# Altium schematic sheet Radio.SchDoc
size B; SheetNumber: 1; SheetTotal: 1
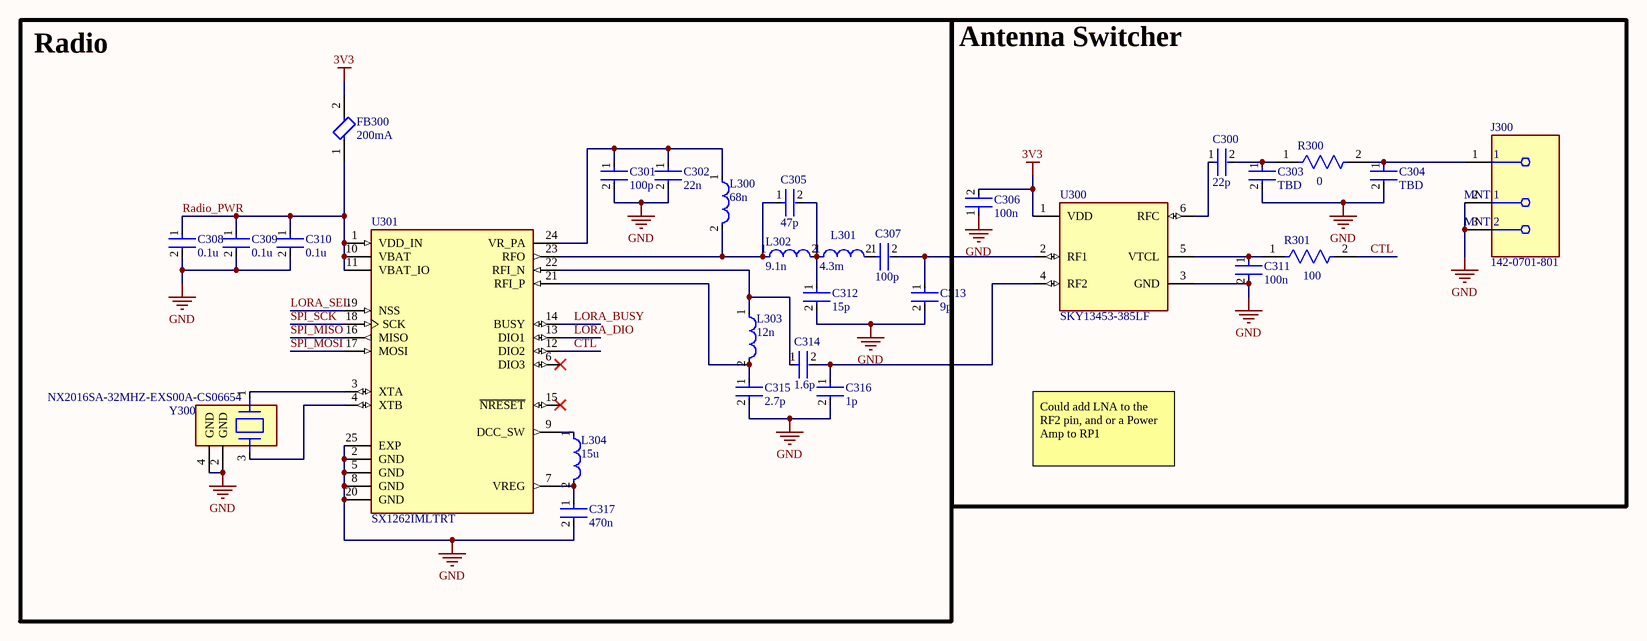
[diagram p0: Radio.SchDoc]

## Parts
C300  Capacitance: 22p  [FP-CL10-IPC_A]  (hidden comment: CL10C681JB8NFNC)
C301  Capacitance: 100p  [FP-CL10-IPC_A]  (hidden comment: CL10C681JB8NFNC)
C302  Capacitance: 22n  [FP-CL10-IPC_A]  (hidden comment: CL10C681JB8NFNC)
C303  Capacitance: TBD  [FP-CL10-IPC_A]  (hidden comment: CL10C681JB8NFNC)
C304  Capacitance: TBD  [FP-CL10-IPC_A]  (hidden comment: CL10C681JB8NFNC)
C305  Capacitance: 47p  [FP-CL10-IPC_A]  (hidden comment: CL10C681JB8NFNC)
C306  Capacitance: 100n  [FP-CL10-IPC_A]  (hidden comment: CL10C681JB8NFNC)
C307  Capacitance: 100p  [FP-CL10-IPC_A]  (hidden comment: CL10C681JB8NFNC)
C308  Capacitance: 0.1u  [FP-CL10-IPC_A]  (hidden comment: CL10C681JB8NFNC)
C309  Capacitance: 0.1u  [FP-CL10-IPC_A]  (hidden comment: CL10C681JB8NFNC)
C310  Capacitance: 0.1u  [FP-CL10-IPC_A]  (hidden comment: CL10C681JB8NFNC)
C311  Capacitance: 100n  [FP-CL10-IPC_A]  (hidden comment: CL10C681JB8NFNC)
C312  Capacitance: 15p  [FP-CL10-IPC_A]  (hidden comment: CL10C681JB8NFNC)
C313  Capacitance: 9p  [FP-CL10-IPC_A]  (hidden comment: CL10C681JB8NFNC)
C314  Capacitance: 1.6p  [FP-CL10-IPC_A]  (hidden comment: CL10C681JB8NFNC)
C315  Capacitance: 2.7p  [FP-CL10-IPC_A]  (hidden comment: CL10C681JB8NFNC)
C316  Capacitance: 1p  [FP-CL10-IPC_A]  (hidden comment: CL10C681JB8NFNC)
C317  Capacitance: 470n  [FP-CL10-IPC_A]  (hidden comment: CL10C681JB8NFNC)
FB300  200mA  [FP-BLM18-0_15-t0_8-IPC_B]
J300  142-0701-801  [FP-142-0701-801-MFG]
L300  68n  [FP-LQM18NN_00-IPC_B]
L301  4.3m  [FP-LQM18NN_00-IPC_B]
L302  9.1n  [FP-LQM18NN_00-IPC_B]
L303  12n  [FP-LQM18NN_00-IPC_B]
L304  15u  [FP-LQM18NN_00-IPC_B]
R300  value 0  [FP-CPF0603-MFG]  (hidden comment: CPF0603B2K15E1)
R301  value 100  [FP-CPF0603-MFG]  (hidden comment: CPF0603B2K15E1)
U300  SKY13453-385LF  [IC_SKY13453-385LF]
U301  SX1262IMLTRT  [QFN50P400X400X100-25N]
Y300  NX2016SA-32MHZ-EXS00A-CS06654  [FP-NX2016SA-MFG]

## Blocks framed on the sheet
Radio: C301 C302 C305 C307-C310 C312-C317 FB300 L300-L304 U301 Y300
Antenna Switcher: C300 C303 C304 C306 C311 J300 R300 R301 U300

## Nets
3V3: C306.2 FB300.2 U300.1(VDD)
GND: C301.2 C302.2 C303.2 C304.2 C306.1 C308.2 C309.2 C310.2 C311.2 C312.2 C313.2 C315.2 C316.2 C317.2 J300.2(MNT_1) J300.3(MNT_2) U300.3(GND) U301.2(GND) U301.5(GND) U301.8(GND) U301.20(GND) U301.25(EXP) Y300.2(GND) Y300.4(GND)
CTL: R301.2 U301.12(DIO2)
LORA_BUSY: U301.14(BUSY)
LORA_DIO: U301.13(DIO1)
LORA_SEL: U301.19(NSS)
Radio_PWR: C308.1 C309.1 C310.1 FB300.1 U301.1(VDD_IN) U301.10(VBAT) U301.11(VBAT_IO)
SPI_MISO: U301.16(MISO)
SPI_MOSI: U301.17(MOSI)
SPI_SCK: U301.18(SCK)
NetC300_1: C300.1 U300.6(RFC)
NetC300_2: C300.2 C303.1 R300.1
NetC301_1: C301.1 C302.1 L300.1 U301.24(VR_PA)
NetC304_1: C304.1 J300.1 R300.2
NetC305_1: C305.1 L300.2 L302.1 U301.23(RFO)
NetC305_2: C305.2 C312.1 L301.1 L302.2
NetC307_1: C307.1 L301.2
NetC307_2: C307.2 C313.1 U300.2(RF1)
NetC311_1: C311.1 R301.1 U300.5(VTCL)
NetC314_1: C314.1 L303.1 U301.22(RFI_N)
NetC314_2: C314.2 C316.1 U300.4(RF2)
NetC315_1: C315.1 L303.2 U301.21(RFI_P)
NetC317_1: C317.1 L304.2 U301.7(VREG)
NetL304_1: L304.1 U301.9(DCC_SW)
NetU301_3: U301.3(XTA) Y300.1
NetU301_4: U301.4(XTB) Y300.3

Not connected (* = marked no-connect by the designer): U301 6(DIO3)* 15(~{NRESET})*

## Notes on the sheet
- Could add LNA to the RF2 pin, and or a Power Amp to RP1

## Library data of the parts
C300-C317 = CMP-13271-001533-1: Cap Ceramic 680pF 50V C0G ±5% Pad SMD 0603 +125°C T/R; Voltage Rating: 50V; Radiation Hardening: No; Length: 0.063inch; Min Operating Temperature: -55°C; Package Quantity: 1; Lead Free: Lead Free; Case Code (Metric): 1608; Thickness: 0.035inch; Width: 0.031inch; Height: 0.8mm; Case/Package: 0603; Tolerance: 5%; Mount: Surface Mount; Dielectric: C0G; Max Operating Temperature: 125°C; Case Code (Imperial): 0603; Packaging: Tape and Reel; Depth: 0.8mm
FB300 = CMP-0686-00463-3: Chip Ferrite Bead, 0603, 120Ω @ 100MHz, 0.4Ω, 25%, 300mA; DC Resistance (DCR): 400mR; Shielding: Unshielded; Impedance: 120R; Number of Lines: 1; Package Quantity: 1; Max Current Rating: 300mA; Case Code (Metric): 1608; REACH SVHC: No SVHC; DC Current: 200mA; Material: Ferrite; Resistor Type: Ferrite Bead; Lead Free: Lead Free; DC Resistance-Max: 400mR; Packaging: Tape and Reel; Case/Package: 0603; Width: 0.8mm; Case Code (Imperial): 0603; Min Operating Temperature: -55°C; Weight: 7.1E-05oz; Max Operating Temperature: 125°C; Series: BLM18B; Max DC Current: 200mA; Termination: SMD/SMT; Length: 1.6mm; Military Standard: Not; Radiation Hardening: No; Depth: 0.8mm; Tolerance: 25%; Height: 0.8mm; Core Material: Ferrite; Test Frequency: 100MHz; Resistance: 400mR; Number of Pins: 2; Current Rating: 200mA; Number of Circuits: 1
J300 = CMP-09588-000002-1: CONN SMA JACK STR 50OHM EDGE MNT; Frequency: 18GHz; Operating Frequency: 0 to 18 GHz; Body Material: Brass; Impedance: 50R; Voltage Rating: 335V; Gender: Female; Body Plating: Gold; Orientation: Straight; Length: 0.44inch; Max Operating Temperature: 165°C; Package Quantity: 5; Packaging: Bulk; Series: SMA; Contact Material: Copper; Min Operating Temperature: -65°C; Depth: 25.58mm; RoHS Compliant: Yes; Case/Package: SMA; Max Frequency: 18GHz; Radiation Hardening: No; Contact Plating: Gold; Mount: Edge; Connector Type: SMA; Fastening Type: Threaded; Termination: Solder
L300-L304 = CMP-06042-016758-1: Multilayer Type Inductor for General Circuits, 0603 (1608), 2200nH, 10%, 1.15Ω, 15mA; Inductor Type: MONOLITHIC; DC Resistance (DCR): 1.15R; Shielding: Shielded; Core Material: Ferrite; Inductance: 2.2uH; Test Frequency: 10MHz; Self Resonant Frequency: 50MHz; Q Factor: 35; Width: 0.031inch; Depth: 0.8mm; Series: LQM18N; Length: 1.6mm; Inductance Tolerance: 10%; Packaging: Tape and Reel; Termination: SMD/SMT; Current Rating: 15mA; DC Current: 15mA; Rated Current-Max: 15mA; Case/Package: 0603; Mount: Surface Mount; RoHS Compliant: Yes; Case Code (Imperial): 0603; Min Operating Temperature: -40°C; Max Operating Temperature: 85°C; Military Standard: Not; REACH SVHC: No SVHC; Lead Free: Lead Free; Case Code (Metric): 1608; Tolerance: 10%; Radiation Hardening: No; Number of Pins: 2; Height: 0.8mm; Package Quantity: 1; Height - Seated (Max): 0.035inch; Max DC Current: 15mA
R300 R301 = CMP-03211-008657-1: RES SMD 2.15KΩ 0.1% 1/16W 0603; Manufacturer: TE Connectivity; Temperature Coefficient: 25ppm/°C; Voltage Rating: 50V; Power Rating: 0.063W; Height: 0.55mm; Series: CPF; ComponentLink2Description: Datasheet; Package: CPF0603; Automotive: No; octopart_url: https://octopart.com/cpf0603b2k15e1-te+connectivity-22739551; Lead Free: Yes; Temperature: -55°C to +155°C; RoHS: TRUE; Ipc Land Pattern Name: RESC15580X45; Temperature Range Low: -55°C; Composition: Thin Film; Device Class L3: Chip SMD Resistors; Category: Res; Octopart: https://octopart.com/cpf0603b2k15e1-te+connectivity-22739551; Resistance: 2.15KΩ; ComponentLink2URL: https://www.te.com/commerce/DocumentDelivery/DDEController?Action=showdoc&DocId=Data+Sheet%7F1773200%7FM%7Fpdf%7FEnglish%7FENG_DS_1773200_M.pdf%7F3-1676481-2; Manufacturer Part Number: CPF0603B2K15E1; packaging: 1k Reel; Tolerance: 0.1%; Temperature Range High: +155°C; Device Class L1: Passive Components; Device Class L2: Resistors
U300 = CMP-031-00006-2: RF Switch IC WLAN SPDT 6 GHz 50Ohm 6-QFN (1x1); MF: Skyworks Solutions; SnapEDA_Link: https://www.snapeda.com/parts/SKY13453-385LF/Skyworks+Solutions+Inc./view-part/?ref=snap; Component Type: Standard; Source: SKY13453-385LF.SchLib; Design Item ID: SKY13453-385LF; MP: SKY13453-385LF; Availability: In Stock; Case/Package: None; Purchase-URL: https://pricing.snapeda.com/search/part/SKY13453-385LF/?ref=eda; Value: *; Price: None; Pins: 6; Check_prices: https://www.snapeda.com/parts/SKY13453-385LF/Skyworks+Solutions+Inc./view-part/?ref=eda
U301 = CMP-013-000000-4: IC RF TxRx Only General ISM < 1GHz LoRaWAN 150MHz ~ 960MHz 24-VFQFN Exposed Pad; MF: Semtech Corporation; Availability: Unavailable; Design Item ID: SX1262IMLTRT; Pin Count: 25; Source: SnapEDAsch.SchLib; Value: *; Package: VFQFN-24 Semtech; SnapEDA_Link: https://www.snapeda.com/parts/SX1262IMLTRT/Semtech%20Corporation/view-part/2781045/?ref=snap; Price: None; MP: SX1262IMLTRT; Component Type: Standard
Y300 = CMP-200220-000017-1: CRYSTAL 32.0000MHZ 8PF SMD; Frequency: 32MHz; ESR (Equivalent Series Resistance): 60R; Ratings: AEC-Q200; Mount: Surface Mount; Case/Package: SMD/SMT; Packaging: Tape and Reel; Load Capacitance: 8pF; Min Operating Temperature: -40°C; Max Operating Temperature: 125°C